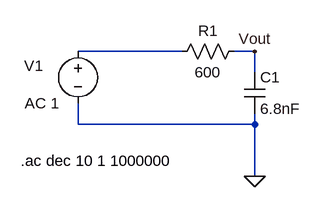
[diagram p0: schematic RC_TimeConstantForADC.asc]
RC_TimeConstantForADC.asc, the LTspice schematic file:
Version 4.1
SHEET 1 880 680
WIRE 112 128 -48 128
WIRE 224 128 192 128
WIRE 224 160 224 128
WIRE -48 240 -48 208
WIRE 224 240 224 224
WIRE 224 240 -48 240
WIRE 224 320 224 240
FLAG 224 320 0
FLAG 224 128 Vout
SYMBOL res 208 112 R90
WINDOW 0 0 56 VBottom 2
WINDOW 3 32 56 VTop 2
SYMATTR InstName R1
SYMATTR Value 600
SYMBOL cap 208 160 R0
SYMATTR InstName C1
SYMATTR Value 6.8nF
SYMATTR SpiceLine V=6
SYMBOL voltage -48 112 R0
WINDOW 0 -83 38 Left 2
WINDOW 3 -82 96 Left 2
WINDOW 123 0 0 Left 0
WINDOW 39 0 0 Left 0
SYMATTR InstName V1
SYMATTR Value AC 1
TEXT -136 296 Left 2 !.ac dec 10 1 1000000

The netlist it stands for:
* RC_TimeConstantForADC.asc
R1 Vout N001 600
C1 Vout 0 6.8nF V=6
V1 N001 0 AC 1
.ac dec 10 1 1000000
.backanno
.end